# EAGLE design screwshield-analog-v1 (EAGLE 5.05)
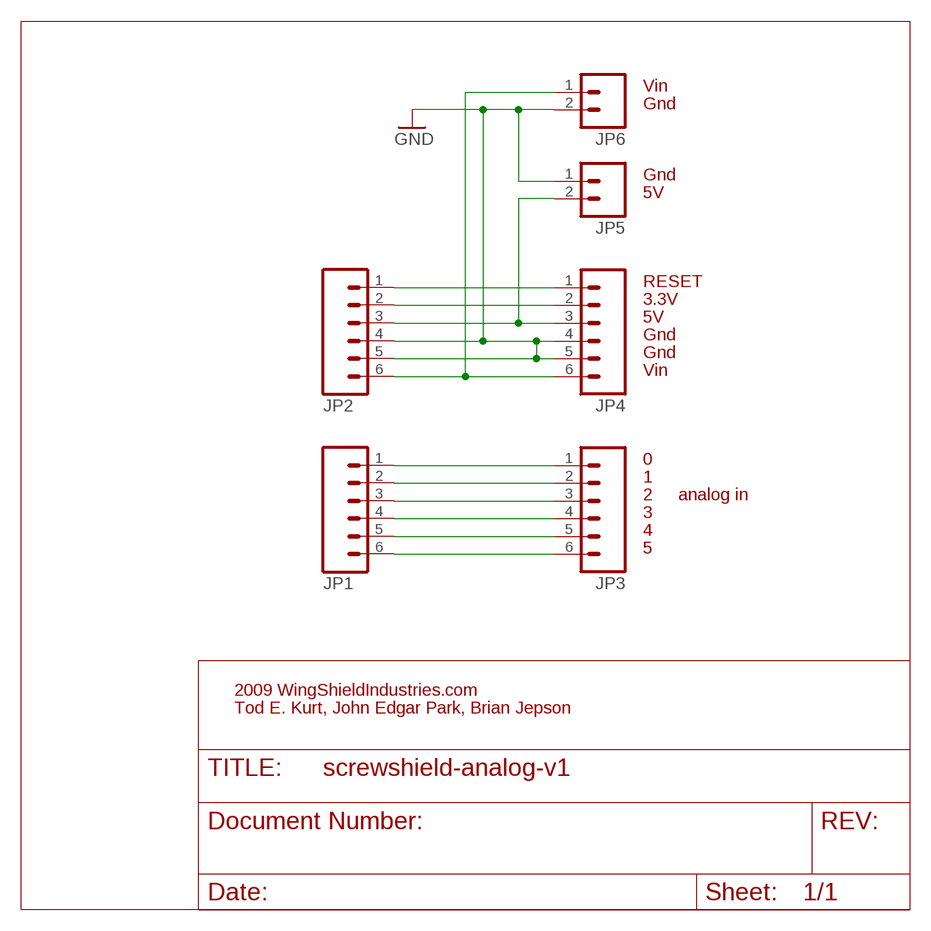
[diagram p0: schematic, sheet 1]

## Parts
JP1  M06LOCK_LONGPADS  [1X06_LOCK_LONGPADS]
JP2  M06LOCK_LONGPADS  [1X06_LOCK_LONGPADS]
JP3  M06-SCREWTERMINAL  [SCREWTERMINAL-3.5MM-6]
JP4  M06-SCREWTERMINAL  [SCREWTERMINAL-3.5MM-6]
JP5  M023.5MM  [SCREWTERMINAL-3.5MM-2]
JP6  M023.5MM  [SCREWTERMINAL-3.5MM-2]

## Nets
3.3V: JP2.2 JP4.2
5V: JP2.3 JP4.3 JP5.2
GND: JP2.4 JP2.5 JP4.4 JP4.5 JP5.1 JP6.2
N$1: JP1.1 JP3.1
N$2: JP1.2 JP3.2
N$3: JP1.3 JP3.3
N$4: JP1.4 JP3.4
N$5: JP1.5 JP3.5
N$6: JP1.6 JP3.6
RESET: JP2.1 JP4.1
VIN: JP2.6 JP4.6 JP6.1

## Notes on the sheet
- Vin
- Gnd
- Gnd
- 5V
- RESET
- 3.3V
- 5V
- Gnd
- Gnd
- Vin
- 0
- 1
- 2 | analog in
- 3
- 4
- 5
- 2009 WingShieldIndustries.com
- Tod E. Kurt, John Edgar Park, Brian Jepson

## Library data of the parts
JP1 JP2 = SparkFun-20090108:M06: Header 6 Standard 6-pin 0.1" header. Use with straight break away headers (SKU : PRT-00116), right angle break away headers (PRT-00553), swiss pins (PRT-00743), machine pins (PRT-00117), and female headers (PRT-00115). Molex polarized connector foot print use with SKU : PRT-08094 with associated crimp pins and housings. NOTES ON THE VARIANTS LOCK and LOCK_LONGPADS... This footprint was designed to help hold the alignment of a through-hole component (i.e. 6-pin header) while soldering it into place. You may notice that each hole has been shifted either up or down by 0.005 of an inch from it's more standard position (which is a perfectly straight line). This slight alteration caused the pins (the squares in the middle) to touch the edges of the holes. Because they are alternating, it causes a "brace" to hold the component in place. 0.005 has proven to be the perfect amount of "off-center" position when using our standard breakaway headers. Although looks a little odd when you look at the bare footprint, once you have a header in there, the alteration is very hard to notice. Also, if you push a header all the way into place, it is covered up entirely on the bottom side. This idea of altering the position of holes to aid alignment will be further integrated into the Sparkfun Library for other footprints. It can help hold any component with 3 or more connection pins.
JP3 JP4 = todstuff:M06-SCREWTERMINAL
JP5 JP6 = SparkFun-20090108:M02: Header 2 Standard 2-pin 0.1" header. Use with straight break away headers (SKU : PRT-00116), right angle break away headers (PRT-00553), swiss pins (PRT-00743), machine pins (PRT-00117), and female headers (PRT-00115). Molex polarized connector foot print use with SKU : PRT-08233 with associated crimp pins and housings.

## Board
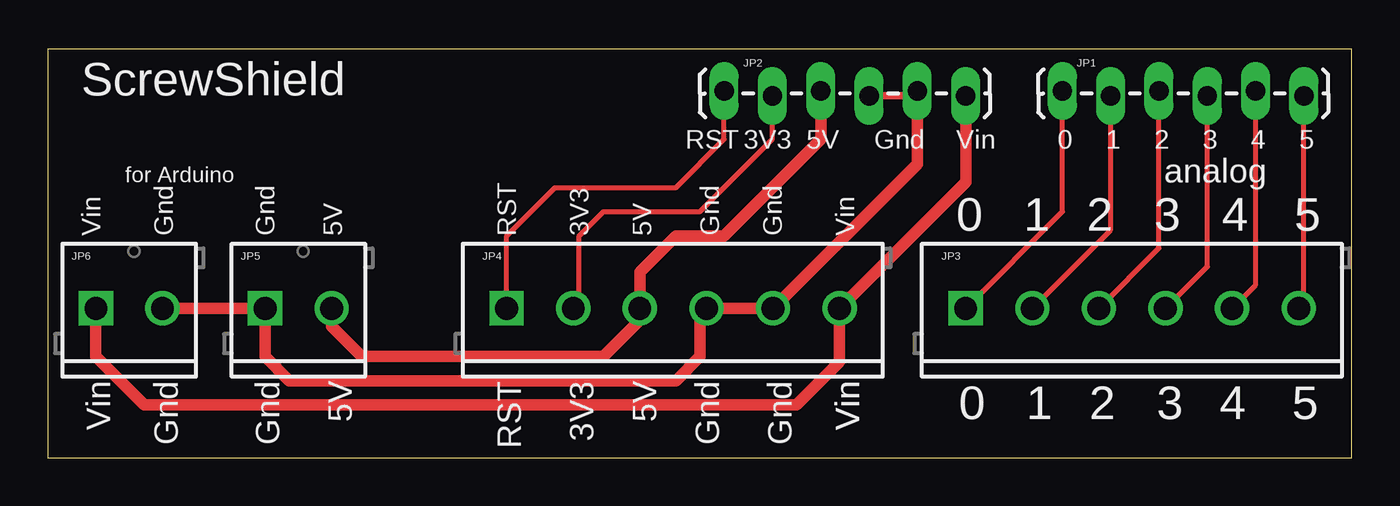
[diagram p1: board, top side]
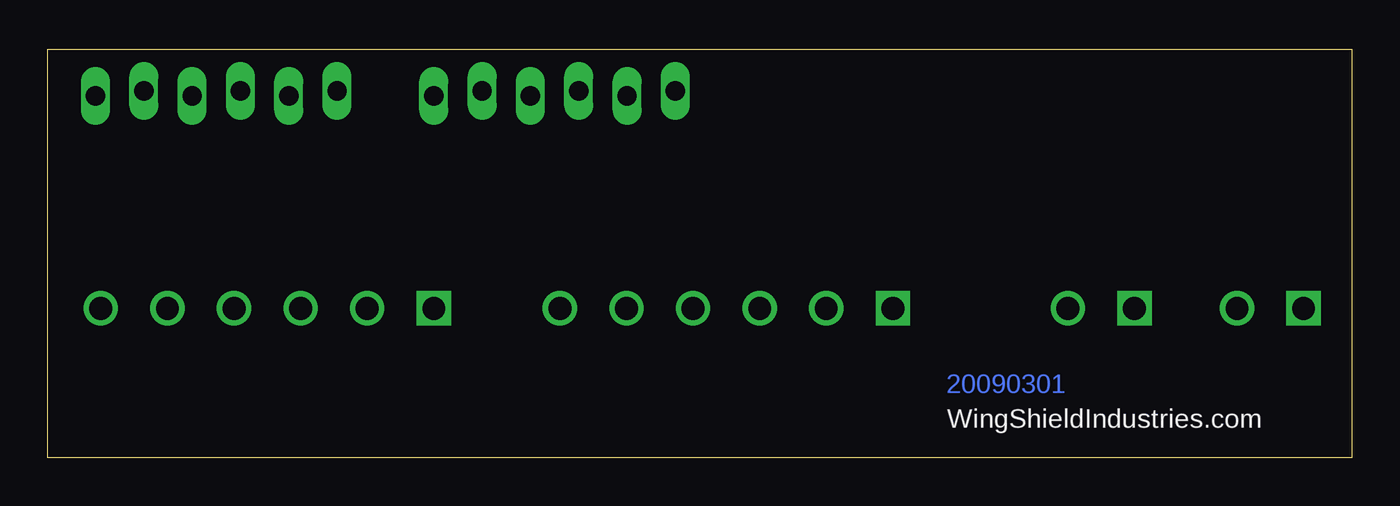
[diagram p2: board, bottom side, seen from below]

Size 68.56 x 21.51 mm. Coordinates in mm from the lower left corner, seen from the top.
Outline: 0,0 68.56,0 68.56,21.51 0,21.51 0,0
Copper layers (1*16): Top 0.035mm / dielectric 1.5mm / Bottom 0.035mm
Design rules "default": minimum track width 10mil, minimum drill 24mil, track to track 8mil, track to pad 8mil, pad to pad 8mil, via to via 8mil, smd to smd 8mil, copper to edge 40mil, drill to drill 8mil, minimum pad ring 10mil, minimum via ring 8mil, stop-mask expansion 4mil, vias tented up to drill 0mil, thermal gap 10mil

### Footprints (pad centres in the part's own frame; a part is rotated, then mirrored left to right if it is on the bottom)
1X06_LOCK_LONGPADS = drill 1.016 long: 1 0,0; 2 2.54,-0.254; 3 5.08,0; 4 7.62,-0.254; 5 10.16,0; 6 12.7,-0.254
SCREWTERMINAL-3.5MM-6 = drill 1.2 square: 1 0,0 | drill 1.2 round: 2 3.5,0; 3 7,0; 4 10.5,0; 5 14,0; 6 17.5,0
SCREWTERMINAL-3.5MM-2 = drill 1.2 square: 1 0,0 | drill 1.2 round: 2 3.5,0

### Placement (x,y rotation side)
JP1  53.34,19.3 0 top
JP2  35.56,19.3 0 top
JP3  48.26,7.87 0 top
JP4  24.13,7.87 0 top
JP5  11.43,7.87 0 top
JP6  2.54,7.87 0 top

### Tracks (layer width: path | path; a pad name or v marks a point on that pad's centre or on a via)
3.3V
  Top 0.254: 38.1,18.03 JP2.2 38.1,16.76 34.29,12.95 29.21,12.95 27.94,11.68 27.94,8.18 JP4.2
5V
  Top 0.254: 40.64,18.03 40.64,18.65 JP2.3
  Top 0.61: 40.64,18.65 40.64,16.76 35.56,11.68 33.02,11.68 31.13,9.79 JP4.3 31.13,7.25 29.21,5.33 16.51,5.33 14.93,6.91 JP5.2
GND
  Top 0.254: JP2.5 45.72,19.05
  Top 0.406: JP2.4 45.72,19.05 JP2.5
  Top 0.61: JP2.5 45.72,15.46 JP4.5 JP4.4 34.29,7.53 34.29,5.33 33.02,4.06 12.7,4.06 11.43,5.33 JP5.1 JP6.2
N$1
  Top 0.254: JP3.1 53.34,12.95 JP1.1
N$2
  Top 0.254: JP3.2 55.88,11.99 JP1.2
N$3
  Top 0.254: JP3.3 58.42,11.03 JP1.3
N$4
  Top 0.254: JP3.4 60.96,10.07 JP1.4
N$5
  Top 0.254: JP3.5 63.5,9.11 JP1.5
N$6
  Top 0.254: JP3.6 66.04,8.15 JP1.6
RESET
  Top 0.254: JP2.1 35.56,16.76 33.02,14.22 26.67,14.22 24.13,11.68 JP4.1
VIN
  Top 0.61: JP2.6 48.26,14.5 JP4.6 41.63,5.05 39.37,2.79 5.08,2.79 2.54,5.33 JP6.1

### Text on the board
Bottom: 20090301
tPlace: ScrewShield | RST | 3V3 | 5V | Gnd | Vin | 0 | 1 | 2 | 3 | 4 | 5 | for Arduino | analog | Vin | Gnd | Gnd | 5V | RST | 3V3 | 5V | Gnd | Gnd | Vin | 0 | 1 | 2 | 3 | 4 | 5 | Vin | Gnd | Gnd | 5V | RST | 3V3 | 5V | Gnd | Gnd | Vin | Vin | 0 | 1 | 2 | 3 | 4 | 5
bPlace: WingShieldIndustries.com